# EAGLE design DragonUSBHost (EAGLE 6.2)
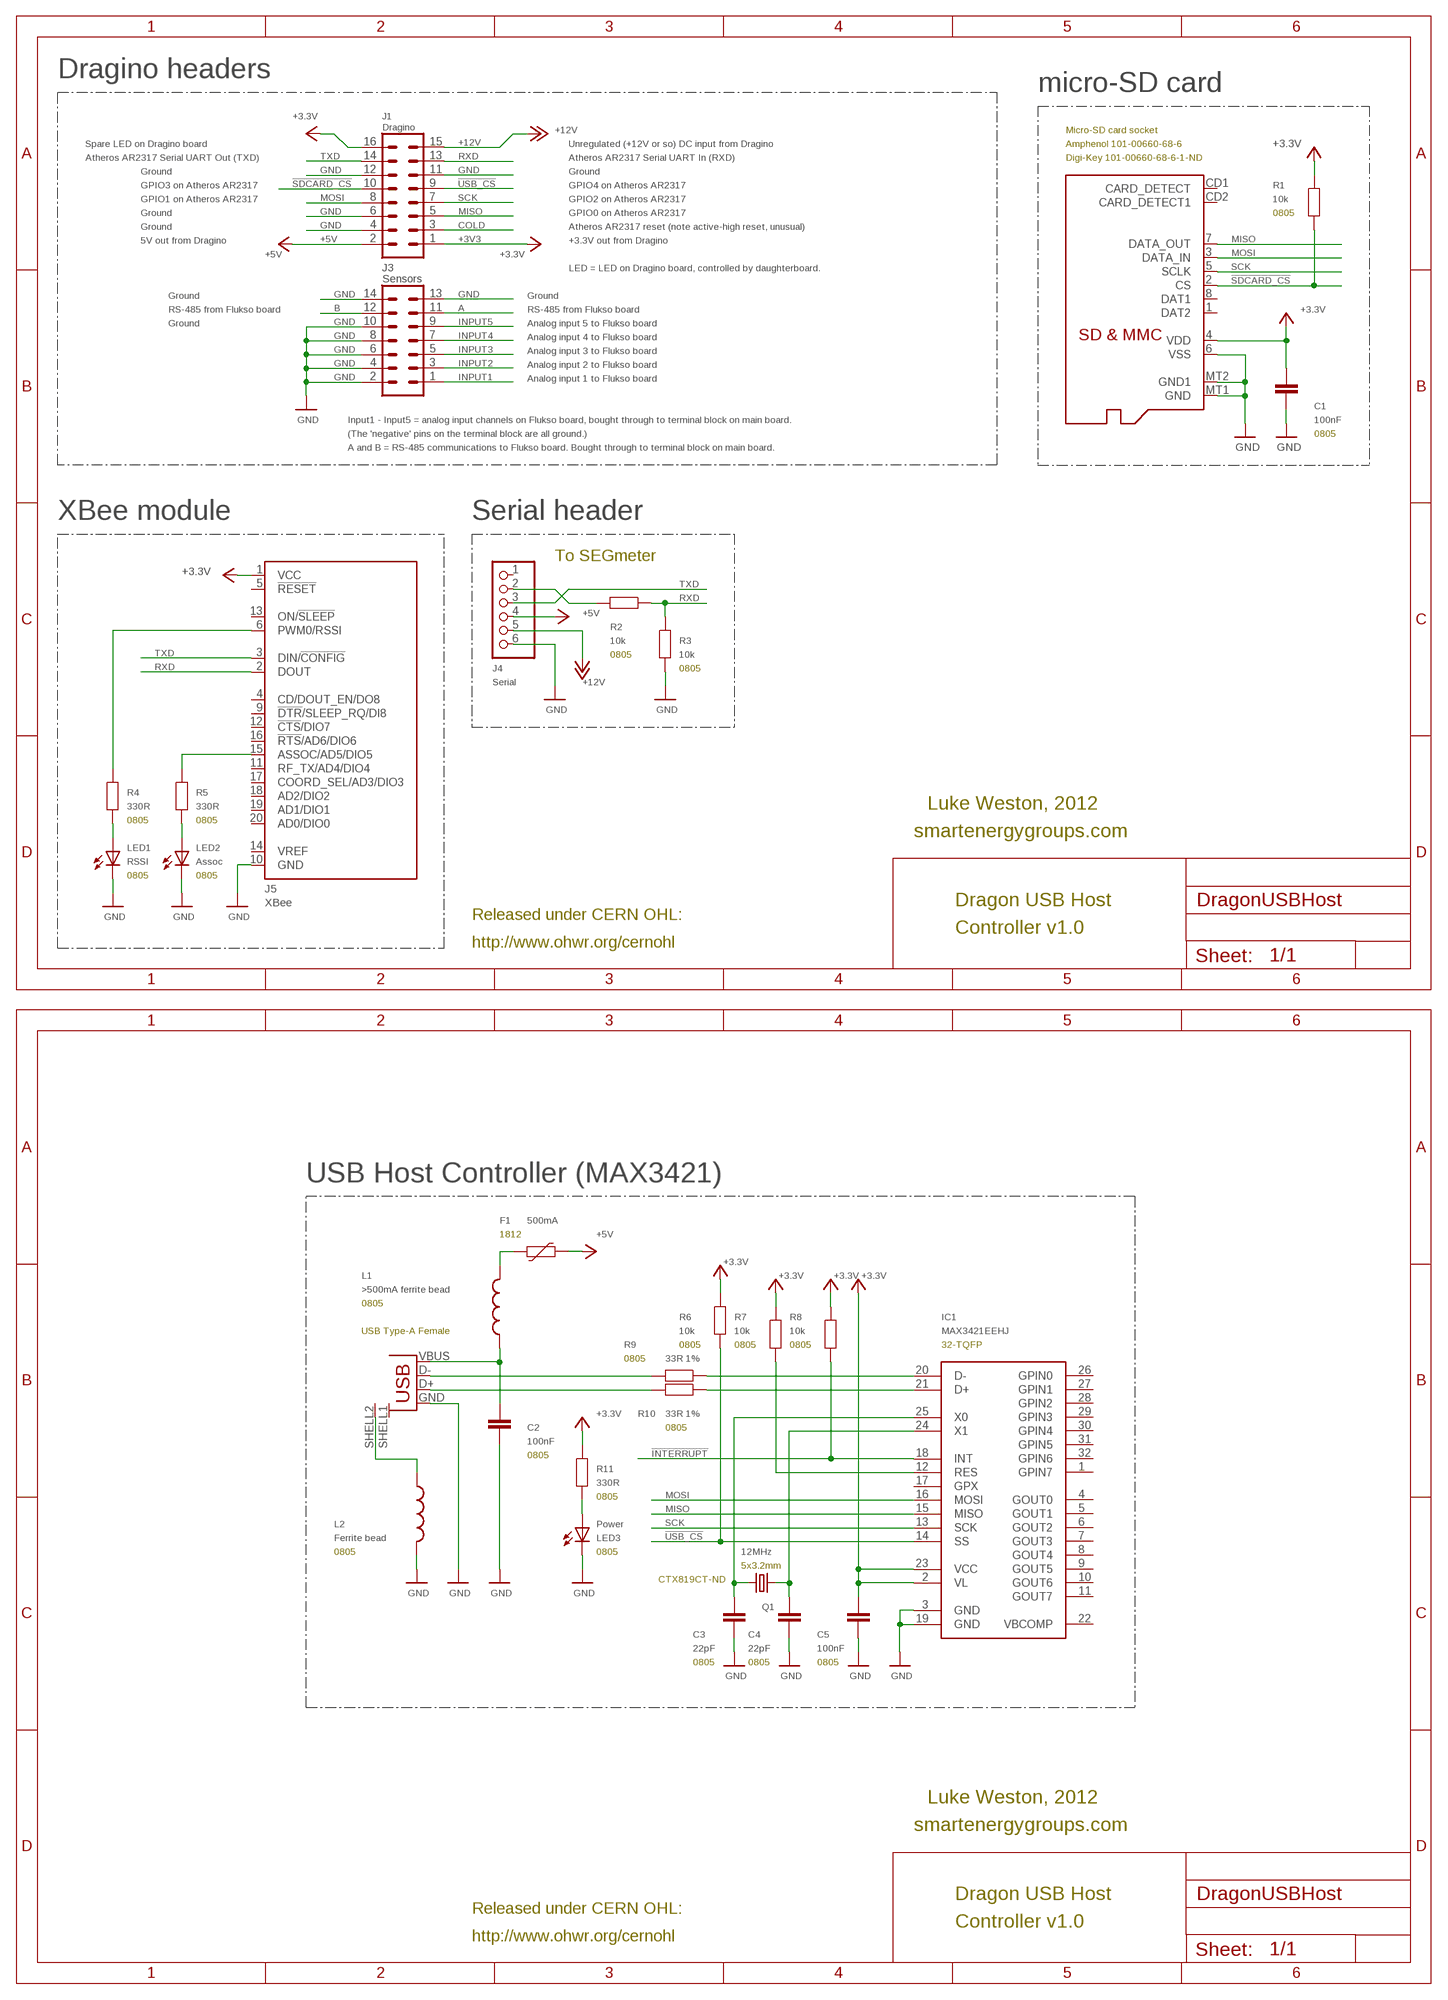
[diagram p0: schematic, sheet 1]

## Parts
C1  100nF  CAP0805  [0805]
C2  100nF  CAP0805  [0805]
C3  22pF  CAP0805  [0805]
C4  22pF  CAP0805  [0805]
C5  100nF  CAP0805  [0805]
F1  500mA  PTC  [1812]
IC1  MAX3421EEHJ  MAX3421ESMD  [TQFP32-5MM]
J1  Dragino  MA08-2  [MA08-2]
J2  MICROSD  [MICROSD]
J3  Sensors  MA07-2  [MA07-2]
J4  Serial  PINHD-1X6  [1X06]
J5  XBee  XBEE-PRO  [XBEE-PRO]
L1  >500mA ferrite bead  INDUCTOR0805-LARGE  [0805-LARGE]
L2  Ferrite bead  INDUCTOR0805-LARGE  [0805-LARGE]
LED1  RSSI  LED0805  [LED-0805]
LED2  Assoc  LED0805  [LED-0805]
LED3  Power  LED0805  [LED-0805]
P1  USB_  [USB-A-S-SILK-FEMALE]
Q1  12MHz  CRYSTAL5X3  [CRYSTAL-SMD-5X3]
R1  10k  RESISTOR0805  [0805]
R2  10k  RESISTOR0805  [0805]
R3  10k  RESISTOR0805  [0805]
R4  330R  RESISTOR0805  [0805]
R5  330R  RESISTOR0805  [0805]
R6  10k  RESISTOR0805  [0805]
R7  10k  RESISTOR0805  [0805]
R8  10k  RESISTOR0805  [0805]
R9  33R 1%  RESISTOR0805  [0805]
R10  33R 1%  RESISTOR0805  [0805]
R11  330R  RESISTOR0805  [0805]

## Nets
!INTERRUPT: IC1.18(INT) R8.1
!RESET: IC1.12(RES) R7.1
!SDCARD_CS: J1.10 J2.2(CS) R1.1
!USB_CS: IC1.14(SS) J1.9 R6.1
+3V3: C1.1 C5.1 IC1.2(VL) IC1.23(VCC) J1.1 J1.16 J2.4(VDD) J5.1(VCC) R1.2 R6.2 R7.2 R8.2 R11.2 ; supply symbol labelled +3.3V
+5V: F1.2 J1.2 J4.4
+12V: J1.15 J4.5
A: J3.11
B: J3.12
COLD: J1.3
GND: C1.2 C2.1 C3.2 C4.2 C5.2 IC1.3(GND) IC1.19(GND) J1.4 J1.6 J1.11 J1.12 J2.6(VSS) J2.MT1(GND) J2.MT2(GND1) J3.2 J3.4 J3.6 J3.8 J3.10 J3.13 J3.14 J4.6 J5.10(GND) L2.2 LED1.C LED2.C LED3.C P1.GND R3.1
INPUT1: J3.1
INPUT2: J3.3
INPUT3: J3.5
INPUT4: J3.7
INPUT5: J3.9
MISO: IC1.15(MISO) J1.5 J2.7(DATA_OUT)
MOSI: IC1.16(MOSI) J1.8 J2.3(DATA_IN)
N$1: P1.D- R9.2
N$2: L2.1 P1.SHELL2
N$3: P1.D+ R10.2
N$4: C2.2 L1.1 P1.VBUS
N$5: IC1.20(D-) R9.1
N$8: LED2.A R5.1
N$9: J5.15(ASSOC/AD5/DIO5) R5.2
N$10: IC1.21(D+) R10.1
N$12: LED1.A R4.1
N$13: J5.6(PWM0/RSSI) R4.2
N$14: J4.2 R2.2
N$27: C3.1 IC1.25(X0) Q1.3
N$30: C4.1 IC1.24(X1) Q1.1
N$44: LED3.A R11.1
RXD: J1.13 J5.2(DOUT) R2.1 R3.2
SCK: IC1.13(SCK) J1.7 J2.5(SCLK)
TXD: J1.14 J4.3 J5.3(DIN/!CONFIG)
VBUS: F1.1 L1.2
Unconnected: IC1.1(GPIN7) IC1.4(GOUT0) IC1.5(GOUT1) IC1.6(GOUT2) IC1.7(GOUT3) IC1.8(GOUT4) IC1.9(GOUT5) IC1.10(GOUT6) IC1.11(GOUT7) IC1.17(GPX) IC1.22(VBCOMP) IC1.26(GPIN0) IC1.27(GPIN1) IC1.28(GPIN2) IC1.29(GPIN3) IC1.30(GPIN4) IC1.31(GPIN5) IC1.32(GPIN6) J2.1(DAT2) J2.8(DAT1) J2.CD1(CARD_DETECT) J2.CD2(CARD_DETECT1) J4.1 J5.4(CD/DOUT_EN/DO8) J5.5(!RESET) J5.9(!DTR!/SLEEP_RQ/DI8) J5.11(RF_TX/AD4/DIO4) J5.12(!CTS!/DIO7) J5.13(ON/!SLEEP) J5.14(VREF) J5.16(!RTS!/AD6/DIO6) J5.17(COORD_SEL/AD3/DIO3) J5.18(AD2/DIO2) J5.19(AD1/DIO1) J5.20(AD0/DIO0) P1.SHELL1

## Notes on the sheet
- Dragino headers
- micro-SD card
- Micro-SD card socket
- Spare LED on Dragino board | Unregulated (+12V or so) DC input from Dragino | Amphenol 101-00660-68-6
- Atheros AR2317 Serial UART Out (TXD) | Atheros AR2317 Serial UART In (RXD) | Digi-Key 101-00660-68-6-1-ND
- Ground | Ground
- GPIO3 on Atheros AR2317 | GPIO4 on Atheros AR2317
- GPIO1 on Atheros AR2317 | GPIO2 on Atheros AR2317
- Ground | GPIO0 on Atheros AR2317 | 0805
- Ground | Atheros AR2317 reset (note active-high reset, unusual)
- 5V out from Dragino | +3.3V out from Dragino
- LED = LED on Dragino board, controlled by daughterboard.
- Ground | Ground
- RS-485 from Flukso board | RS-485 from Flukso board
- Ground | Analog input 5 to Flukso board
- Analog input 4 to Flukso board
- Analog input 3 to Flukso board
- Analog input 2 to Flukso board
- Analog input 1 to Flukso board
- Input1 - Input5 = analog input channels on Flukso board, bought through to terminal block on main board.
- (The 'negative' pins on the terminal block are all ground.) | 0805
- A and B = RS-485 communications to Flukso board. Bought through to terminal block on main board.
- XBee module | Serial header
- To SEGmeter
- 0805
- 0805
- Luke Weston, 2012
- 0805 | 0805
- smartenergygroups.com
- 0805 | 0805
- Dragon USB Host
- Released under CERN OHL:
- Controller v1.0
- http://www.ohwr.org/cernohl
- USB Host Controller (MAX3421)
- 1812
- 0805
- USB Type-A Female
- 0805 | 0805 | 0805 | 32-TQFP
- 0805
- 0805
- 0805
- 0805
- 0805 | 0805
- 5x3.2mm
- CTX819CT-ND
- 0805 | 0805 | 0805
- Luke Weston, 2012
- smartenergygroups.com
- Dragon USB Host
- Released under CERN OHL:
- Controller v1.0
- http://www.ohwr.org/cernohl

## Library data of the parts
C1-C5 = freetronics-master-v1:CAP: Capacitor Standard 0603 ceramic capacitor, and 0.1" leaded capacitor.
F1 = freetronics-luke:PTC: Polymeric PTC ("Polyfuse")
IC1 = freetronics-master-v1:MAX3421E: USB Peripheral/Host Controller w/ SPI
J1 = con-lstb:MA08-2: PIN HEADER; OC_FARNELL: unknown; OC_NEWARK: unknown
J2 = adafruit:MICROSD: Micro-SD / Transflash card holder with SPI pinout For the 3M # 2908-05WB-MG and/or 4UCON #19656 push-push type
J3 = con-lstb:MA07-2: PIN HEADER; OC_FARNELL: unknown; OC_NEWARK: unknown
J4 = pinhead:PINHD-1X6: PIN HEADER
J5 = maxstream:XBEE: XBee (TM) /XBee-PRO(TM) OEM RF Modules Source: MaxStream, Inc. xbee_productmanual.pdf; MPN: XBP24-AWI-001; OC_FARNELL: 1337916; OC_NEWARK: 42M2667
L1 L2 = freetronics-master-v1:INDUCTOR: Inductors Basic Inductor/Choke - 0603 and 1206. Footprints are not proven and vary greatly between part numbers.
LED1-LED3 = freetronics-master-v1:LED: LEDs Standard schematic elements and footprints for 5mm, 3mm, 1206, and 0603 sized LEDs. 5mm - Spark Fun Electronics SKU : COM-00529 (and others)
P1 = freetronics-master-v1:USB: USB Connectors USB-B-PTH is fully proven SKU : PRT-00139 USB-miniB is fully proven SKU : PRT-00587 USB-A-PCB is untested. USB-A-H is throughly reviewed, but untested. Spark Fun Electronics SKU : PRT-00437 USB-B-SMT is throughly reviewed, but untested. Needs silkscreen touching up. USB-A-S has not been used/tested USB-MB-H has not been used/tested
Q1 = SparkFun:CRYSTAL: Crystals Various standard crystals. Proven footprints. Spark Fun Electronics SKU : COM-00534
R1-R11 = freetronics-master-v1:RESISTOR: Resistor Basic schematic elements and footprints for 0603, 1206, and PTH 1/10th watt (small) resistors.

## Net classes
3 usbvcc: width 0.203 mm, drill 0.305 mm, clearance 0.203 mm

## Board
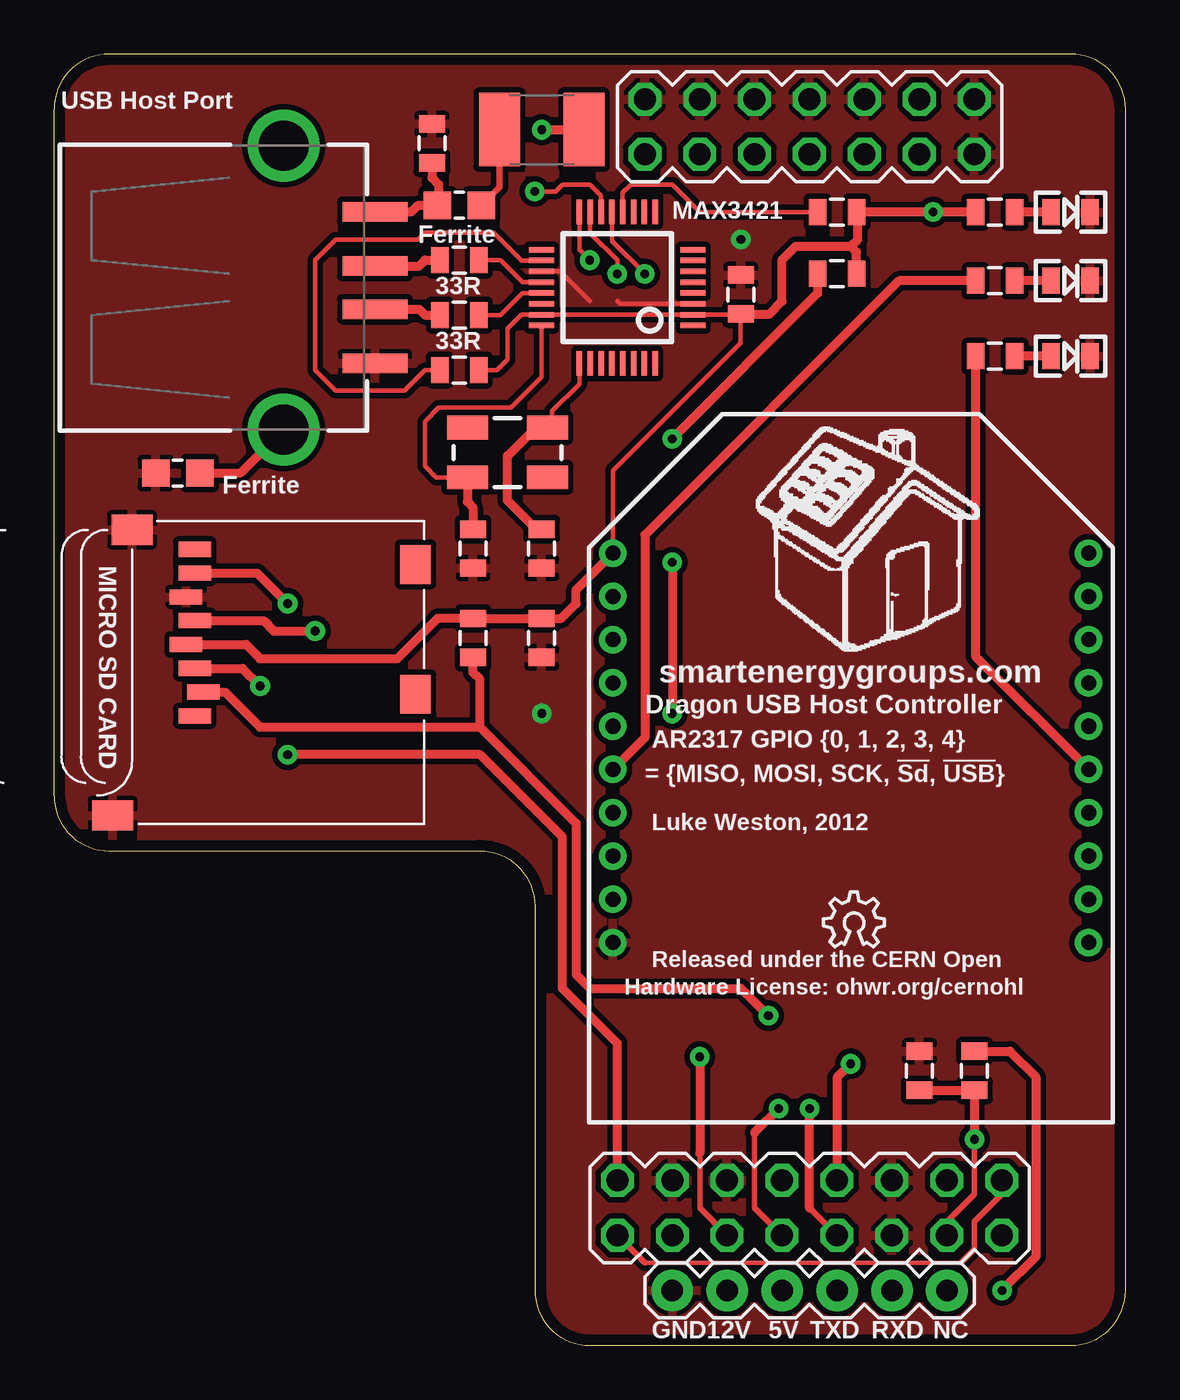
[diagram p1: board, top side]
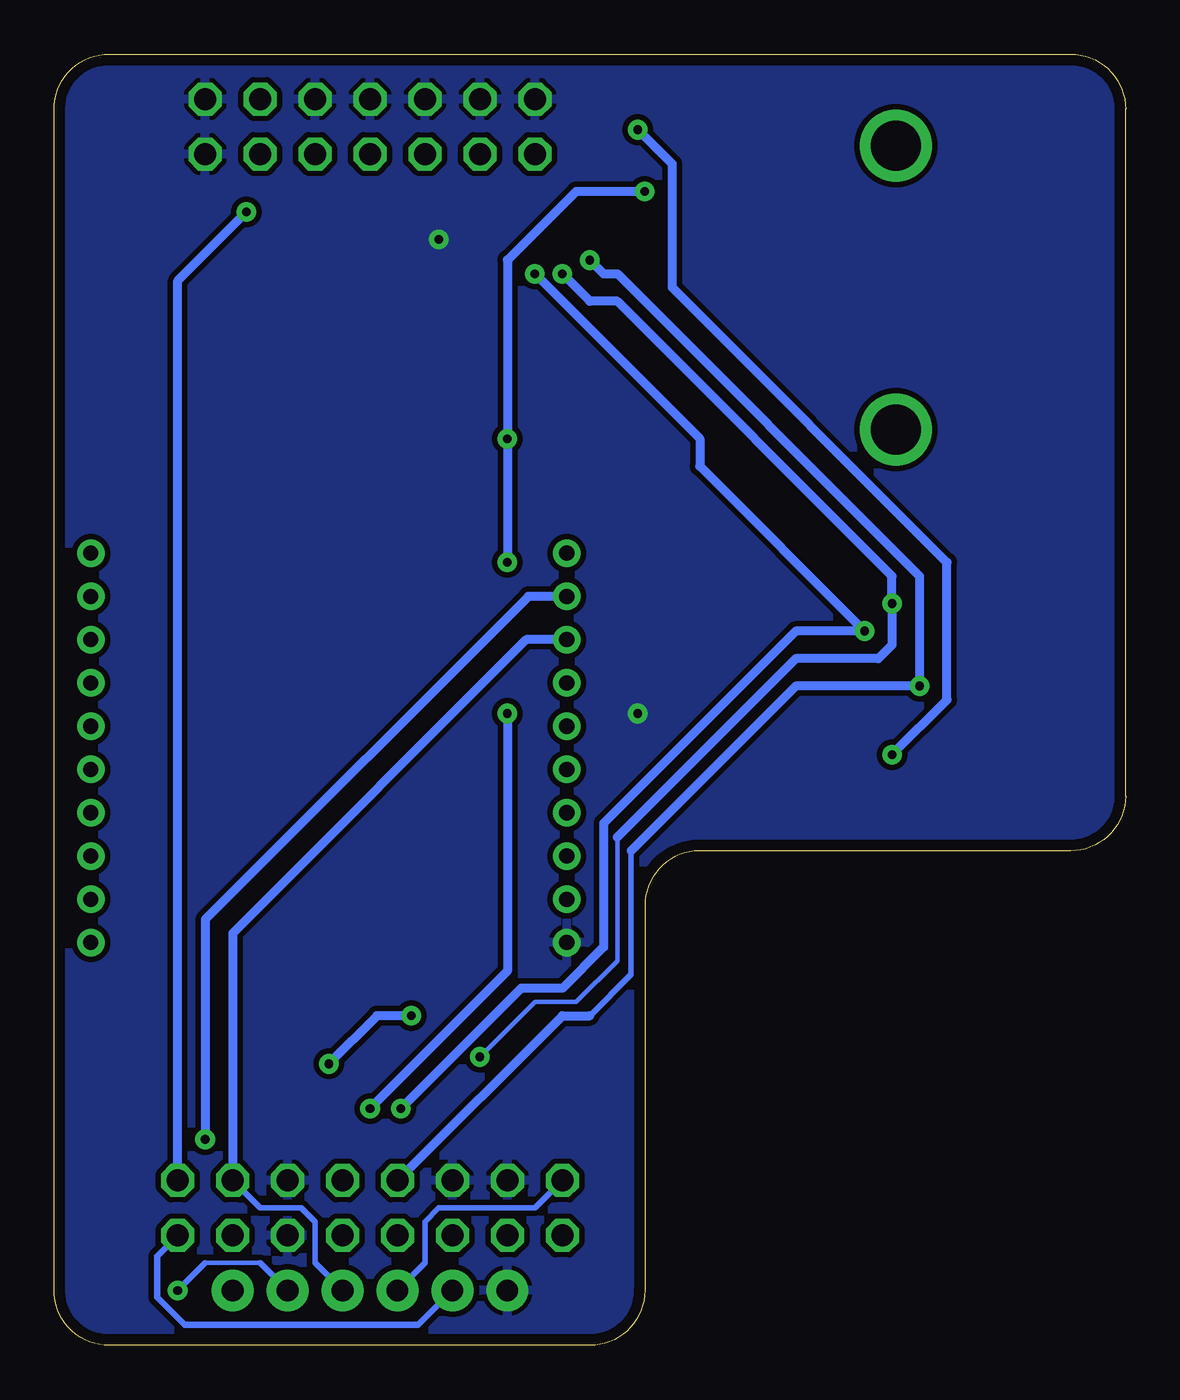
[diagram p2: board, bottom side, seen from below]

Size 49.53 x 59.69 mm. Coordinates in mm from the lower left corner, seen from the top.
Outline: 22.22,2.54 arc90 24.77,0 46.99,0 arc90 49.53,2.54 49.53,57.15 arc90 46.99,59.69 2.54,59.69 arc90 0,57.15 0,25.4 arc90 2.54,22.86 19.68,22.86 arc-90 22.22,20.32 22.22,2.54
Copper layers (1*16): Top 0.035mm / dielectric 1.5mm / Bottom 0.035mm
Design rules: minimum track width 8mil, minimum drill 0.4mm, track to track 8mil, track to pad 8mil, pad to pad 8mil, via to via 8mil, smd to smd 8mil, copper to edge 20mil, drill to drill 8mil, minimum pad ring 8mil, minimum via ring 10mil, stop-mask expansion 3mil, vias tented up to drill 25mil, thermal gap 8mil

### Footprints (pad centres in the part's own frame; a part is rotated, then mirrored left to right if it is on the bottom)
0805 = smd 0.8 x 1.2: 1 -0.9,0; 2 0.9,0
1812 = smd 1.9 x 3.4: 1 -1.95,0; 2 1.95,0
TQFP32-5MM = smd 1.143 x 0.254: 1 -3.5,1.75; 2 -3.5,1.25; 3 -3.5,0.75; 4 -3.5,0.25; 5 -3.5,-0.25; 6 -3.5,-0.75; 7 -3.5,-1.25; 8 -3.5,-1.75; 17 3.5,-1.75; 18 3.5,-1.25; 19 3.5,-0.75; 20 3.5,-0.25; 21 3.5,0.25; 22 3.5,0.75; 23 3.5,1.25; 24 3.5,1.75 | smd 0.254 x 1.143: 9 -1.75,-3.5; 10 -1.25,-3.5; 11 -0.75,-3.5; 12 -0.25,-3.5; 13 0.25,-3.5; 14 0.75,-3.5; 15 1.25,-3.5; 16 1.75,-3.5; 25 1.75,3.5; 26 1.25,3.5; 27 0.75,3.5; 28 0.25,3.5; 29 -0.25,3.5; 30 -0.75,3.5; 31 -1.25,3.5; 32 -1.75,3.5
MA08-2 = drill 1.016 octagon: 1 -8.89,-1.27; 2 -8.89,1.27; 3 -6.35,-1.27; 4 -6.35,1.27; 5 -3.81,-1.27; 6 -3.81,1.27; 7 -1.27,-1.27; 8 -1.27,1.27; 9 1.27,-1.27; 10 1.27,1.27; 11 3.81,-1.27; 12 3.81,1.27; 13 6.35,-1.27; 14 6.35,1.27; 15 8.89,-1.27; 16 8.89,1.27
MICROSD = smd 0.7 x 1.5: 1 9,-10.64; 2 7.9,-10.24; 3 6.8,-10.64; 4 5.7,-11.04; 5 4.6,-10.64; 6 3.5,-11.04; 7 2.4,-10.64; 8 1.3,-10.64 | smd 1.8 x 1.4: CD1 2,-0.44; CD2 8,-0.44 | smd 1.4 x 1.9: MT1 0.4,-13.54; MT2 13.6,-14.44
MA07-2 = drill 1.016 octagon: 1 -7.62,-1.27; 2 -7.62,1.27; 3 -5.08,-1.27; 4 -5.08,1.27; 5 -2.54,-1.27; 6 -2.54,1.27; 7 0,-1.27; 8 0,1.27; 9 2.54,-1.27; 10 2.54,1.27; 11 5.08,-1.27; 12 5.08,1.27; 13 7.62,-1.27; 14 7.62,1.27
1X06 = drill 1 pad 1.93: 1 -6.35,0; 2 -3.81,0; 3 -1.27,0; 4 1.27,0; 5 3.81,0; 6 6.35,0
XBEE-PRO = drill 0.7 pad 1.27: 1 -11,9; 2 -11,7; 3 -11,5; 4 -11,3; 5 -11,1; 6 -11,-1; 7 -11,-3; 8 -11,-5; 9 -11,-7; 10 -11,-9; 11 11,-9; 12 11,-7; 13 11,-5; 14 11,-3; 15 11,-1; 16 11,1; 17 11,3; 18 11,5; 19 11,7; 20 11,9
0805-LARGE = smd 1.27 x 1.27: 1 -1.016,0; 2 1.016,0
LED-0805 = smd 0.8 x 1.2: A -0.9,0; C 0.9,0
USB-A-S-SILK-FEMALE = smd 3 x 0.9: D+ 7.212,-1; D- 7.212,1; GND 7.212,-3.5; VBUS 7.212,3.5 | drill 2.311: SHELL1 3,6.566; SHELL2 3,-6.566
CRYSTAL-SMD-5X3 = smd 1.9 x 1.1: 1 -1.85,-1.15; 2 1.85,-1.15; 3 1.85,1.15; 4 -1.85,1.15

### Placement (x,y rotation side)
C1  22.54,32.7 270 top
C2  17.46,55.56 270 top
C3  22.54,36.83 270 top
C4  19.37,36.83 270 top
C5  31.75,48.58 90 top
F1  22.54,56.2 0 top
IC1  26.04,48.9 180 top
J1  34.92,6.35 0 top
J2  17.14,38.1 270 top
J3  34.92,56.34 0 top
J4  34.92,2.54 180 top
J5  36.83,27.62 0 top
L1  18.73,52.7 0 top
L2  5.71,40.32 180 top
LED1  46.99,49.21 0 top
LED2  46.99,45.72 0 top
LED3  46.99,52.39 0 top
P1  7.62,48.9 0 top
Q1  20.95,41.27 0 top
R1  19.37,32.7 90 top
R2  42.55,12.7 90 top
R3  40,12.7 270 top
R4  43.5,49.21 180 top
R5  43.5,45.72 180 top
R6  36.2,49.53 0 top
R7  36.2,52.39 0 top
R8  18.73,45.09 0 top
R9  18.73,50.16 180 top
R10  18.73,47.62 180 top
R11  43.5,52.39 180 top
U$21  [OSHW_6X100_NOTEXT]  35.56,18.41 0 top

### Tracks (layer width: path | path; a pad name or v marks a point on that pad's centre or on a via)
!INTERRUPT
  Top 0.203: R8.1 17.14,45.09 16.19,44.13 13.02,44.13 12.07,45.09 12.07,50.16 13.02,51.12 16.83,51.12 17.14,51.44 20.32,51.44 21.61,50.15 IC1.18
!RESET
  Top 0.203: IC1.12 26.29,53.27 26.67,53.66 28.57,53.66 29.84,52.39 R7.1
!SDCARD_CS  (via drill 0.4)
  Top 0.406: v36.83,13.02 36.2,12.38 J1.10 | J2.2 7.9,30.2 9.53,28.57 19.68,28.57 | 19.68,28.57 24.13,24.13 24.13,17.14 24.77,16.51 31.75,16.51 v33.02,15.24 | 19.68,28.57 19.68,30.8 19.37,31.11 R1.1
  Bottom 0.406: v33.02,15.24 34.61,15.24 v36.83,13.02
!USB_CS  (via drill 0.4)
  Top 0.203: IC1.14 25.29,53.14 24.77,53.66 23.49,53.66 23.18,53.34 v22.22,53.34
  Top 0.254: J1.9 34.92,6.35
  Top 0.406: 34.92,6.35 v34.92,10.95 | v28.57,36.2 v28.57,29.21 | v28.57,41.91 35.3,48.63 R6.1
  Bottom 0.406: v22.22,53.34 25.4,53.34 28.57,50.16 v28.57,41.91 v28.57,36.2 | v28.57,29.21 28.57,17.3 v34.92,10.95
+3V3  (via drill 0.4)
  Top 0.203: 27.3,3.81 41.91,3.81 | J5.1 25.83,40.44 31.72,46.32 31.72,47.65 | 37.15,52.34 R7.2 | 31.72,47.65 IC1.2 IC1.23 21.61,47.65 20.95,46.99 20.95,45.56 20.48,45.09 R8.2 | 31.72,47.65 C5.1
  Top 0.254: J1.1 27.3,3.81 | 41.91,3.81 42.55,4.45 42.55,5.71 43.81,6.99 J1.16
  Top 0.406: J2.4 8.88,32.4 9.53,31.75 15.88,31.75 17.73,33.6 R1.2 C1.1 23.44,33.6 24.13,34.29 24.13,34.92 J5.1 | R11.2 v40.64,52.39 R7.2 | 36.83,50.8 34.29,50.8 33.66,50.16 33.66,48.26 33.07,47.68 C5.1 | 36.83,50.8 37.15,51.12 37.15,52.34 | R6.2 37.09,50.53 36.83,50.8
  Bottom 0.406: J1.16 43.81,49.21 v40.64,52.39
+5V  (via drill 0.4)
  Top 0.406: J1.2 26.04,13.97 23.49,16.51 23.49,23.5 19.68,27.3 v10.79,27.3 | v22.54,56.2 F1.2
  Bottom 0.254: J4.4 32.38,3.81 32.38,5.71 31.75,6.35 27.3,6.35 J1.2
  Bottom 0.406: v10.79,27.3 8.26,29.84 8.26,36.2 20.95,48.9 20.95,54.61 v22.54,56.2
+12V
  Bottom 0.305: J4.5 32.7,0.95 43.5,0.95 44.77,2.22 44.77,4.13 J1.15
GND  (via drill 0.4)
  Top 0.203: 24.77,48.26 23.38,49.65 IC1.19 | IC1.3 26.15,48.15 26.04,48.26
  other vias: 31.75,51.12 22.54,29.21
  pour Top (isolate 0.254): -0.95,60.64 50.8,60.64 50.8,-0.95 -0.95,-0.95
  pour Bottom (isolate 0.254): -0.95,60.64 50.8,60.64 50.8,-0.95 -0.95,-0.95
MISO  (via drill 0.4)
  Top 0.203: IC1.15 24.79,51.41 26.04,50.16 v26.04,49.53
  Top 0.254: J1.5 29.84,6.35 29.84,8.89
  Top 0.406: J2.7 9.38,35.7 v10.79,34.29 | v29.84,13.34 29.84,8.89
  Bottom 0.203: 23.49,23.5 23.49,17.78 25.4,15.88 27.3,15.88 v29.84,13.34
  Bottom 0.406: v26.04,49.53 24.77,48.26 23.49,48.26 10.79,35.56 v10.79,34.29 10.79,32.38 11.43,31.75 15.24,31.75 23.49,23.5
MOSI  (via drill 0.4)
  Top 0.203: IC1.16 24.29,50.65 v24.77,50.16
  Top 0.406: J2.3 8.71,31.3 v9.53,30.48
  Bottom 0.203: 9.53,34.92 v9.53,30.48
  Bottom 0.254: 24.77,15.24 22.86,17.14 22.86,22.86
  Bottom 0.406: J1.8 26.04,15.24 24.77,15.24 | 22.86,22.86 15.24,30.48 v9.53,30.48 9.53,35.56 23.49,49.53 24.13,49.53 v24.77,50.16
N$1
  Top 0.406: P1.D- 16.88,49.9 17.14,50.16 R9.2
N$2
  Top 0.406: L2.1 8.61,40.32 P1.SHELL2
N$3
  Top 0.406: P1.D+ 16.88,47.9 17.14,47.62 R10.2
N$4
  Top 0.203: 17.78,52.77 L1.1
  Top 0.406: P1.VBUS 16.52,52.4 16.83,52.7 L1.1 | C2.2 17.46,53.98 17.78,53.66 17.78,52.77
N$5
  Top 0.203: IC1.20 21.66,49.15 20.64,50.16 R9.1
N$8
  Top 0.406: LED2.A R5.1
N$9
  Top 0.406: R5.2 42.6,31.86 J5.15
N$10
  Top 0.203: IC1.21 21.66,48.65 20.64,47.62 R10.1
N$12
  Top 0.406: LED1.A R4.1
N$13
  Top 0.406: J5.6 27.3,28.1 27.3,37.47 39.05,49.21 R4.2
N$14  (via drill 0.4)
  Top 0.406: R2.2 44.19,13.6 45.4,12.38 45.4,4.13 v43.81,2.54
  Bottom 0.203: 40,3.81 42.55,3.81
  Bottom 0.254: J4.2 40,3.81 | 42.55,3.81 v43.81,2.54
N$27
  Top 0.203: IC1.25 24.29,44.45 23.02,43.18 23.02,42.64 Q1.3
  Top 0.406: C3.1 22.28,37.73 20.95,39.05 20.95,41.12 22.07,42.23 22.61,42.23 Q1.3
N$30
  Top 0.203: IC1.24 22.54,44.76 21.11,43.34 17.78,43.34 17.14,42.7 17.14,40.64 17.66,40.12 Q1.1
  Top 0.406: Q1.1 19.11,39 19.37,38.73 C4.1
N$44
  Top 0.406: LED3.A R11.1
RXD  (via drill 0.4)
  Top 0.254: v42.55,9.53 42.55,6.99 41.27,5.71 J1.13
  Top 0.406: v42.55,9.53 R2.1 R3.2
  Bottom 0.406: v42.55,9.53 42.55,19.68 27.61,34.62 J5.2
SCK  (via drill 0.4)
  Top 0.203: IC1.13 25.79,51.05 v27.3,49.53
  Top 0.254: J1.7 32.38,6.35 32.38,9.84
  Top 0.406: J2.5 9.68,33.5 10.16,33.02 v12.07,33.02 | 32.38,9.84 v33.5,10.95
  Bottom 0.406: v27.3,49.53 19.68,41.91 19.68,40.64 v12.07,33.02 15.24,33.02 24.13,24.13 24.13,18.41 26.04,16.51 27.94,16.51 v33.5,10.95
TXD
  Bottom 0.254: J4.3 37.46,3.81 37.46,5.71 38.1,6.35 40,6.35 J1.14
  Bottom 0.406: J1.14 41.27,19.05 27.7,32.62 J5.3
VBUS
  Top 0.305: F1.1 20.59,53.55 L1.2

### Text on the board
tPlace: USB Host Port | MAX3421 | Ferrite | 33R | 33R | Ferrite | MICRO SD CARD | smartenergygroups.com | Dragon USB Host Controller | AR2317 GPIO {0, 1, 2, 3, 4} | = {MISO, MOSI, SCK, !Sd!, !USB!} | Luke Weston, 2012 | Released under the CERN Open | Hardware License: ohwr.org/cernohl | GND | 12V | 5V | TXD | RXD | NC